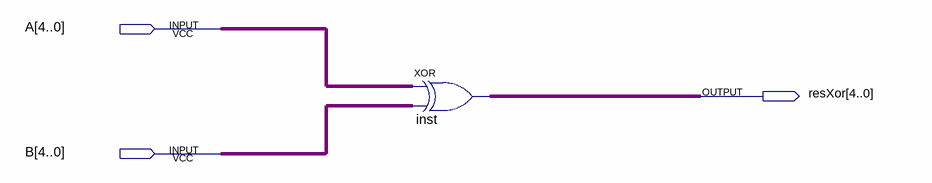
[diagram p0: schematic sheet]
// Quartus schematic A_xor_B.bdf as structural Verilog: 1 symbols, 3 pins
module A_xor_B (
  input  [4:0] A,
  input  [4:0] B,
  output [4:0] resXor
);

  assign resXor = A ^ B;  // XOR inst, 5 bits wide
endmodule
